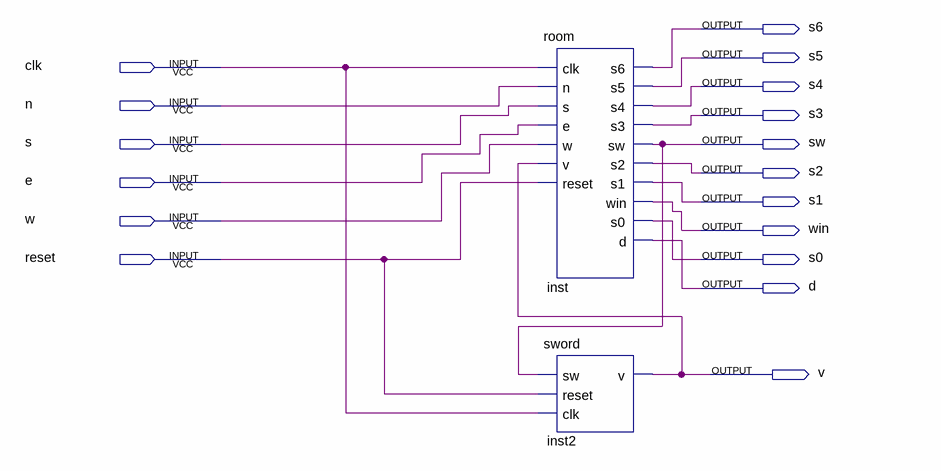
[diagram p0: schematic sheet]
// Quartus schematic Game.bdf as structural Verilog: 2 symbols, 17 pins
module Game (
  input  clk,
  input  n,
  input  s,
  input  e,
  input  w,
  input  reset,
  output s6,
  output s5,
  output s4,
  output s3,
  output sw,
  output s2,
  output s1,
  output win,
  output s0,
  output d,
  output v
);

  room inst (
    .clk(clk), .n(n), .s(s), .e(e), .w(w), .v(v), .reset(reset), .s6(s6), .s5(s5), .s4(s4), .s3(s3), .sw(sw),
    .s2(s2), .s1(s1), .win(win), .s0(s0), .d(d));
  sword inst2 (.sw(sw), .reset(reset), .clk(clk), .v(v));
endmodule
